# Altium schematic sheet [06] - DRAM.SchDoc: DRAM
size A4; Organization: Bjørn T. Brodtkorb; Address1: Frode Rinnans veg 161; Address2: 7050 Trondheim; DocumentNumber: 7; Revision: 1.0; SheetNumber: 7; SheetTotal: 13
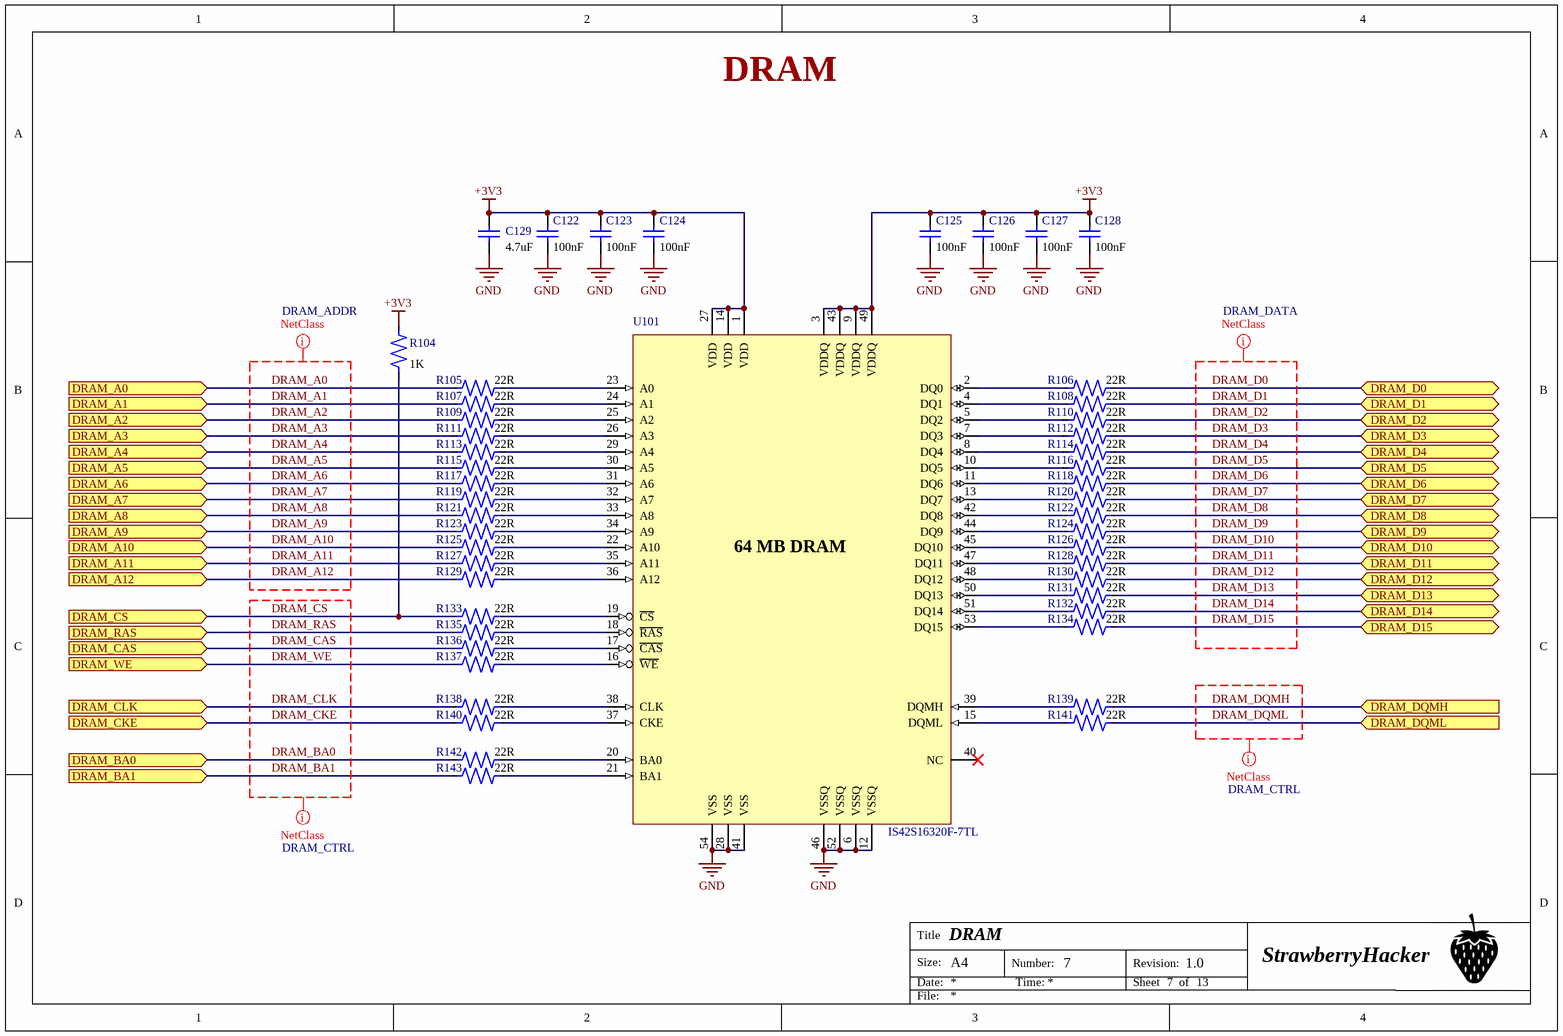
[diagram p0: [06] - DRAM.SchDoc]

## Parts
C122  value 100nF  [C0402]  (hidden comment: 04023C103KAT2A)
C123  value 100nF  [C0402]  (hidden comment: 04023C103KAT2A)
C124  value 100nF  [C0402]  (hidden comment: 04023C103KAT2A)
C125  value 100nF  [C0402]  (hidden comment: 04023C103KAT2A)
C126  value 100nF  [C0402]  (hidden comment: 04023C103KAT2A)
C127  value 100nF  [C0402]  (hidden comment: 04023C103KAT2A)
C128  value 100nF  [C0402]  (hidden comment: 04023C103KAT2A)
C129  value 4.7uF  [C0402]  (hidden comment: 04023C103KAT2A)
R104  value 1K  [R0402]  (hidden comment: CRCW04020000Z0ED)
R105  value 22R  [R0402]  (hidden comment: CRCW04020000Z0ED)
R106  value 22R  [R0402]  (hidden comment: CRCW04020000Z0ED)
R107  value 22R  [R0402]  (hidden comment: CRCW04020000Z0ED)
R108  value 22R  [R0402]  (hidden comment: CRCW04020000Z0ED)
R109  value 22R  [R0402]  (hidden comment: CRCW04020000Z0ED)
R110  value 22R  [R0402]  (hidden comment: CRCW04020000Z0ED)
R111  value 22R  [R0402]  (hidden comment: CRCW04020000Z0ED)
R112  value 22R  [R0402]  (hidden comment: CRCW04020000Z0ED)
R113  value 22R  [R0402]  (hidden comment: CRCW04020000Z0ED)
R114  value 22R  [R0402]  (hidden comment: CRCW04020000Z0ED)
R115  value 22R  [R0402]  (hidden comment: CRCW04020000Z0ED)
R116  value 22R  [R0402]  (hidden comment: CRCW04020000Z0ED)
R117  value 22R  [R0402]  (hidden comment: CRCW04020000Z0ED)
R118  value 22R  [R0402]  (hidden comment: CRCW04020000Z0ED)
R119  value 22R  [R0402]  (hidden comment: CRCW04020000Z0ED)
R120  value 22R  [R0402]  (hidden comment: CRCW04020000Z0ED)
R121  value 22R  [R0402]  (hidden comment: CRCW04020000Z0ED)
R122  value 22R  [R0402]  (hidden comment: CRCW04020000Z0ED)
R123  value 22R  [R0402]  (hidden comment: CRCW04020000Z0ED)
R124  value 22R  [R0402]  (hidden comment: CRCW04020000Z0ED)
R125  value 22R  [R0402]  (hidden comment: CRCW04020000Z0ED)
R126  value 22R  [R0402]  (hidden comment: CRCW04020000Z0ED)
R127  value 22R  [R0402]  (hidden comment: CRCW04020000Z0ED)
R128  value 22R  [R0402]  (hidden comment: CRCW04020000Z0ED)
R129  value 22R  [R0402]  (hidden comment: CRCW04020000Z0ED)
R130  value 22R  [R0402]  (hidden comment: CRCW04020000Z0ED)
R131  value 22R  [R0402]  (hidden comment: CRCW04020000Z0ED)
R132  value 22R  [R0402]  (hidden comment: CRCW04020000Z0ED)
R133  value 22R  [R0402]  (hidden comment: CRCW04020000Z0ED)
R134  value 22R  [R0402]  (hidden comment: CRCW04020000Z0ED)
R135  value 22R  [R0402]  (hidden comment: CRCW04020000Z0ED)
R136  value 22R  [R0402]  (hidden comment: CRCW04020000Z0ED)
R137  value 22R  [R0402]  (hidden comment: CRCW04020000Z0ED)
R138  value 22R  [R0402]  (hidden comment: CRCW04020000Z0ED)
R139  value 22R  [R0402]  (hidden comment: CRCW04020000Z0ED)
R140  value 22R  [R0402]  (hidden comment: CRCW04020000Z0ED)
R141  value 22R  [R0402]  (hidden comment: CRCW04020000Z0ED)
R142  value 22R  [R0402]  (hidden comment: CRCW04020000Z0ED)
R143  value 22R  [R0402]  (hidden comment: CRCW04020000Z0ED)
U101  IS42S16320F-7TL  [IS42S16320F-7TL]

## Ports
DRAM_A0 (in), DRAM_A1 (in), DRAM_A2 (in), DRAM_A3 (in), DRAM_A4 (in), DRAM_A5 (in), DRAM_A6 (in), DRAM_A7 (in), DRAM_A8 (in), DRAM_A9 (in), DRAM_A10 (in), DRAM_A11 (in), DRAM_A12 (in), DRAM_BA0 (in), DRAM_BA1 (in), DRAM_CAS (in), DRAM_CKE (in), DRAM_CLK (in), DRAM_CS (in), DRAM_D0 (bidir), DRAM_D1 (bidir), DRAM_D2 (bidir), DRAM_D3 (bidir), DRAM_D4 (bidir), DRAM_D5 (bidir), DRAM_D6 (bidir), DRAM_D7 (bidir), DRAM_D8 (bidir), DRAM_D9 (bidir), DRAM_D10 (bidir), DRAM_D11 (bidir), DRAM_D12 (bidir), DRAM_D13 (bidir), DRAM_D14 (bidir), DRAM_D15 (bidir), DRAM_DQMH (in), DRAM_DQML (in), DRAM_RAS (in), DRAM_WE (in)

## Nets
+3V3: C122.2 C123.2 C124.2 C125.2 C126.2 C127.2 C128.2 C129.2 R104.2 U101.1(VDD) U101.3(VDDQ) U101.9(VDDQ) U101.14(VDD) U101.27(VDD) U101.43(VDDQ) U101.49(VDDQ)
GND: C122.1 C123.1 C124.1 C125.1 C126.1 C127.1 C128.1 C129.1 U101.6(VSSQ) U101.12(VSSQ) U101.28(VSS) U101.41(VSS) U101.46(VSSQ) U101.52(VSSQ) U101.54(VSS)
DRAM_A0: R105.1 ; port DRAM_A0
DRAM_A1: R107.1 ; port DRAM_A1
DRAM_A2: R109.1 ; port DRAM_A2
DRAM_A3: R111.1 ; port DRAM_A3
DRAM_A4: R113.1 ; port DRAM_A4
DRAM_A5: R115.1 ; port DRAM_A5
DRAM_A6: R117.1 ; port DRAM_A6
DRAM_A7: R119.1 ; port DRAM_A7
DRAM_A8: R121.1 ; port DRAM_A8
DRAM_A9: R123.1 ; port DRAM_A9
DRAM_A10: R125.1 ; port DRAM_A10
DRAM_A11: R127.1 ; port DRAM_A11
DRAM_A12: R129.1 ; port DRAM_A12
DRAM_BA0: R142.1 ; port DRAM_BA0
DRAM_BA1: R143.1 ; port DRAM_BA1
DRAM_CAS: R136.1 ; port DRAM_CAS
DRAM_CKE: R140.1 ; port DRAM_CKE
DRAM_CLK: R138.1 ; port DRAM_CLK
DRAM_CS: R104.1 R133.1 ; port DRAM_CS
DRAM_D0: R106.2 ; port DRAM_D0
DRAM_D1: R108.2 ; port DRAM_D1
DRAM_D2: R110.2 ; port DRAM_D2
DRAM_D3: R112.2 ; port DRAM_D3
DRAM_D4: R114.2 ; port DRAM_D4
DRAM_D5: R116.2 ; port DRAM_D5
DRAM_D6: R118.2 ; port DRAM_D6
DRAM_D7: R120.2 ; port DRAM_D7
DRAM_D8: R122.2 ; port DRAM_D8
DRAM_D9: R124.2 ; port DRAM_D9
DRAM_D10: R126.2 ; port DRAM_D10
DRAM_D11: R128.2 ; port DRAM_D11
DRAM_D12: R130.2 ; port DRAM_D12
DRAM_D13: R131.2 ; port DRAM_D13
DRAM_D14: R132.2 ; port DRAM_D14
DRAM_D15: R134.2 ; port DRAM_D15
DRAM_DQMH: R139.2 ; port DRAM_DQMH
DRAM_DQML: R141.2 ; port DRAM_DQML
DRAM_RAS: R135.1 ; port DRAM_RAS
DRAM_WE: R137.1 ; port DRAM_WE
NetR105_2: R105.2 U101.23(A0)
NetR106_1: R106.1 U101.2(DQ0)
NetR107_2: R107.2 U101.24(A1)
NetR108_1: R108.1 U101.4(DQ1)
NetR109_2: R109.2 U101.25(A2)
NetR110_1: R110.1 U101.5(DQ2)
NetR111_2: R111.2 U101.26(A3)
NetR112_1: R112.1 U101.7(DQ3)
NetR113_2: R113.2 U101.29(A4)
NetR114_1: R114.1 U101.8(DQ4)
NetR115_2: R115.2 U101.30(A5)
NetR116_1: R116.1 U101.10(DQ5)
NetR117_2: R117.2 U101.31(A6)
NetR118_1: R118.1 U101.11(DQ6)
NetR119_2: R119.2 U101.32(A7)
NetR120_1: R120.1 U101.13(DQ7)
NetR121_2: R121.2 U101.33(A8)
NetR122_1: R122.1 U101.42(DQ8)
NetR123_2: R123.2 U101.34(A9)
NetR124_1: R124.1 U101.44(DQ9)
NetR125_2: R125.2 U101.22(A10)
NetR126_1: R126.1 U101.45(DQ10)
NetR127_2: R127.2 U101.35(A11)
NetR128_1: R128.1 U101.47(DQ11)
NetR129_2: R129.2 U101.36(A12)
NetR130_1: R130.1 U101.48(DQ12)
NetR131_1: R131.1 U101.50(DQ13)
NetR132_1: R132.1 U101.51(DQ14)
NetR133_2: R133.2 U101.19(~{CS})
NetR134_1: R134.1 U101.53(DQ15)
NetR135_2: R135.2 U101.18(~{RAS})
NetR136_2: R136.2 U101.17(~{CAS})
NetR137_2: R137.2 U101.16(~{WE})
NetR138_2: R138.2 U101.38(CLK)
NetR139_1: R139.1 U101.39(DQMH)
NetR140_2: R140.2 U101.37(CKE)
NetR141_1: R141.1 U101.15(DQML)
NetR142_2: R142.2 U101.20(BA0)
NetR143_2: R143.2 U101.21(BA1)

Not connected (* = marked no-connect by the designer): U101 40(NC)*

## Layout directives
net class DRAM_ADDR: DRAM_A0, DRAM_A1, DRAM_A2, DRAM_A3, DRAM_A4, DRAM_A5, DRAM_A6, DRAM_A7, DRAM_A8, DRAM_A9, DRAM_A10, DRAM_A11, DRAM_A12
net class DRAM_CTRL: DRAM_BA0, DRAM_BA1, DRAM_CAS, DRAM_CKE, DRAM_CLK, DRAM_CS, DRAM_DQMH, DRAM_DQML, DRAM_RAS, DRAM_WE
net class DRAM_DATA: DRAM_D0, DRAM_D1, DRAM_D2, DRAM_D3, DRAM_D4, DRAM_D5, DRAM_D6, DRAM_D7, DRAM_D8, DRAM_D9, DRAM_D10, DRAM_D11, DRAM_D12, DRAM_D13, DRAM_D14, DRAM_D15

## Notes on the sheet
- DRAM
- Title
- Size:
- Date:
- A4
- Number:
- Time:
- Revision:
- Sheet
- of
- StrawberryHacker
- File:
- (in symbol IS42S16320F-7TL) 64 MB DRAM

## Library data of the parts
C122-C129 = 04023C103KAT2A: C0402
R104-R143 = CRCW04020000Z0ED: R0402
U101 = IS42S16320F-7TL: SDRAM 512Mb 32Mx16 TSOP; Clock cycle time: 7.5 ns; Clock frequency: 143 MHz; Supplier 1: Digi-Key; Supplier Part Number 1: 706-1450-5-ND